# Altium schematic sheet 21.SchDoc
size 297 x 209 mm
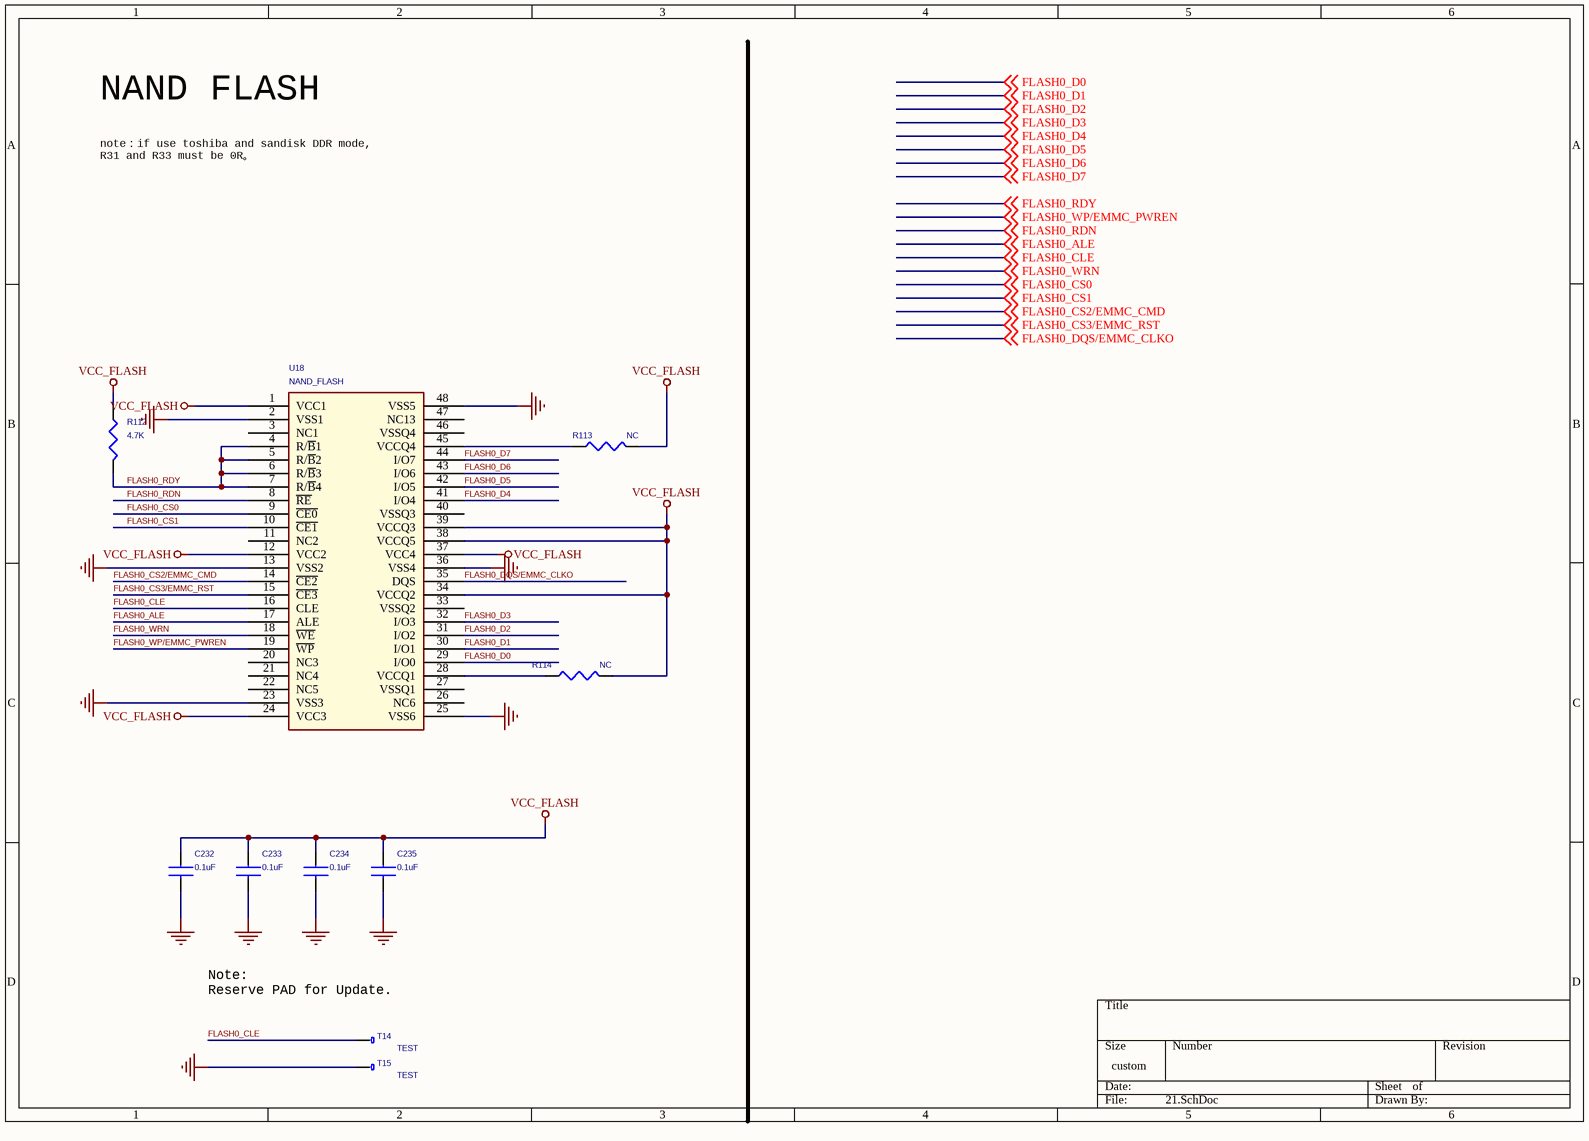
[diagram p0: 21.SchDoc]

## Parts
C232  0.1uF  [C0603]
C233  0.1uF  [C0603]
C234  0.1uF  [C0603]
C235  0.1uF  [C0603]
R112  4.7K  [R0402]
R113  NC  [R0402]
R114  NC  [R0402]
T14  TEST  [TEST]
T15  TEST  [TEST]
U18  NAND_FLASH  [TSOP1-48]

## Nets
GND: C232.1 C233.1 C234.1 C235.1 T15.1 U18.2(VSS1) U18.13(VSS2) U18.23(VSS3) U18.25(VSS6) U18.36(VSS4) U18.48(VSS5)
VCC_FLASH: C232.2 C233.2 C234.2 C235.2 R112.1 R113.2 R114.2 U18.1(VCC1) U18.12(VCC2) U18.24(VCC3) U18.34(VCCQ2) U18.37(VCC4) U18.38(VCCQ5) U18.39(VCCQ3)
FLASH0_ALE: U18.17(ALE) ; off-sheet FLASH0_ALE
FLASH0_CLE: T14.1 U18.16(CLE) ; off-sheet FLASH0_CLE
FLASH0_CS0: U18.9(~{CE0}) ; off-sheet FLASH0_CS0
FLASH0_CS1: U18.10(~{CE1}) ; off-sheet FLASH0_CS1
FLASH0_CS2/EMMC_CMD: U18.14(~{CE2}) ; off-sheet FLASH0_CS2/EMMC_CMD
FLASH0_CS3/EMMC_RST: U18.15(~{CE3}) ; off-sheet FLASH0_CS3/EMMC_RST
FLASH0_D0: U18.29(I/O0) ; off-sheet FLASH0_D0
FLASH0_D1: U18.30(I/O1) ; off-sheet FLASH0_D1
FLASH0_D2: U18.31(I/O2) ; off-sheet FLASH0_D2
FLASH0_D3: U18.32(I/O3) ; off-sheet FLASH0_D3
FLASH0_D4: U18.41(I/O4) ; off-sheet FLASH0_D4
FLASH0_D5: U18.42(I/O5) ; off-sheet FLASH0_D5
FLASH0_D6: U18.43(I/O6) ; off-sheet FLASH0_D6
FLASH0_D7: U18.44(I/O7) ; off-sheet FLASH0_D7
FLASH0_DQS/EMMC_CLKO: U18.35(DQS) ; off-sheet FLASH0_DQS/EMMC_CLKO
FLASH0_RDN: U18.8(~{RE}) ; off-sheet FLASH0_RDN
FLASH0_RDY: R112.2 U18.4(R/~{B}1) U18.5(R/~{B}2) U18.6(R/~{B}3) U18.7(R/~{B}4) ; off-sheet FLASH0_RDY
FLASH0_WP/EMMC_PWREN: U18.19(~{WP}) ; off-sheet FLASH0_WP/EMMC_PWREN
FLASH0_WRN: U18.18(~{WE}) ; off-sheet FLASH0_WRN
NetR113_1: R113.1 U18.45(VCCQ4)
NetR114_1: R114.1 U18.28(VCCQ1)

Not connected (* = marked no-connect by the designer): U18 3(NC1) 11(NC2) 20(NC3) 21(NC4) 22(NC5) 26(NC6) 27(VSSQ1) 33(VSSQ2) 40(VSSQ3) 46(VSSQ4) 47(NC13)

## Notes on the sheet
- NAND FLASH
- note：if use toshiba and sandisk DDR mode,
  R31 and R33 must be 0R。
- (near T14) Note:
  Reserve PAD for Update.

## Library data of the parts
C232-C235 = CAP NP_Dup3: RoHS CHIP CAP 0.1uF +10/-10% X7R
R112 = RESISTOR_Dup1: ROHS CHIP RES 4.7K 1/16W +/-5%
R113 R114 = RESISTOR_Dup1
T14 T15 = TEST_1
U18 = NANDFLASH_0: NAND Flash,2.7V,3.3V,3.6V,2G*8,N/A,-40℃~85℃,TSOP-48P; NAND FLASH: 1